# EAGLE design SuperFuzz (EAGLE 5.11)
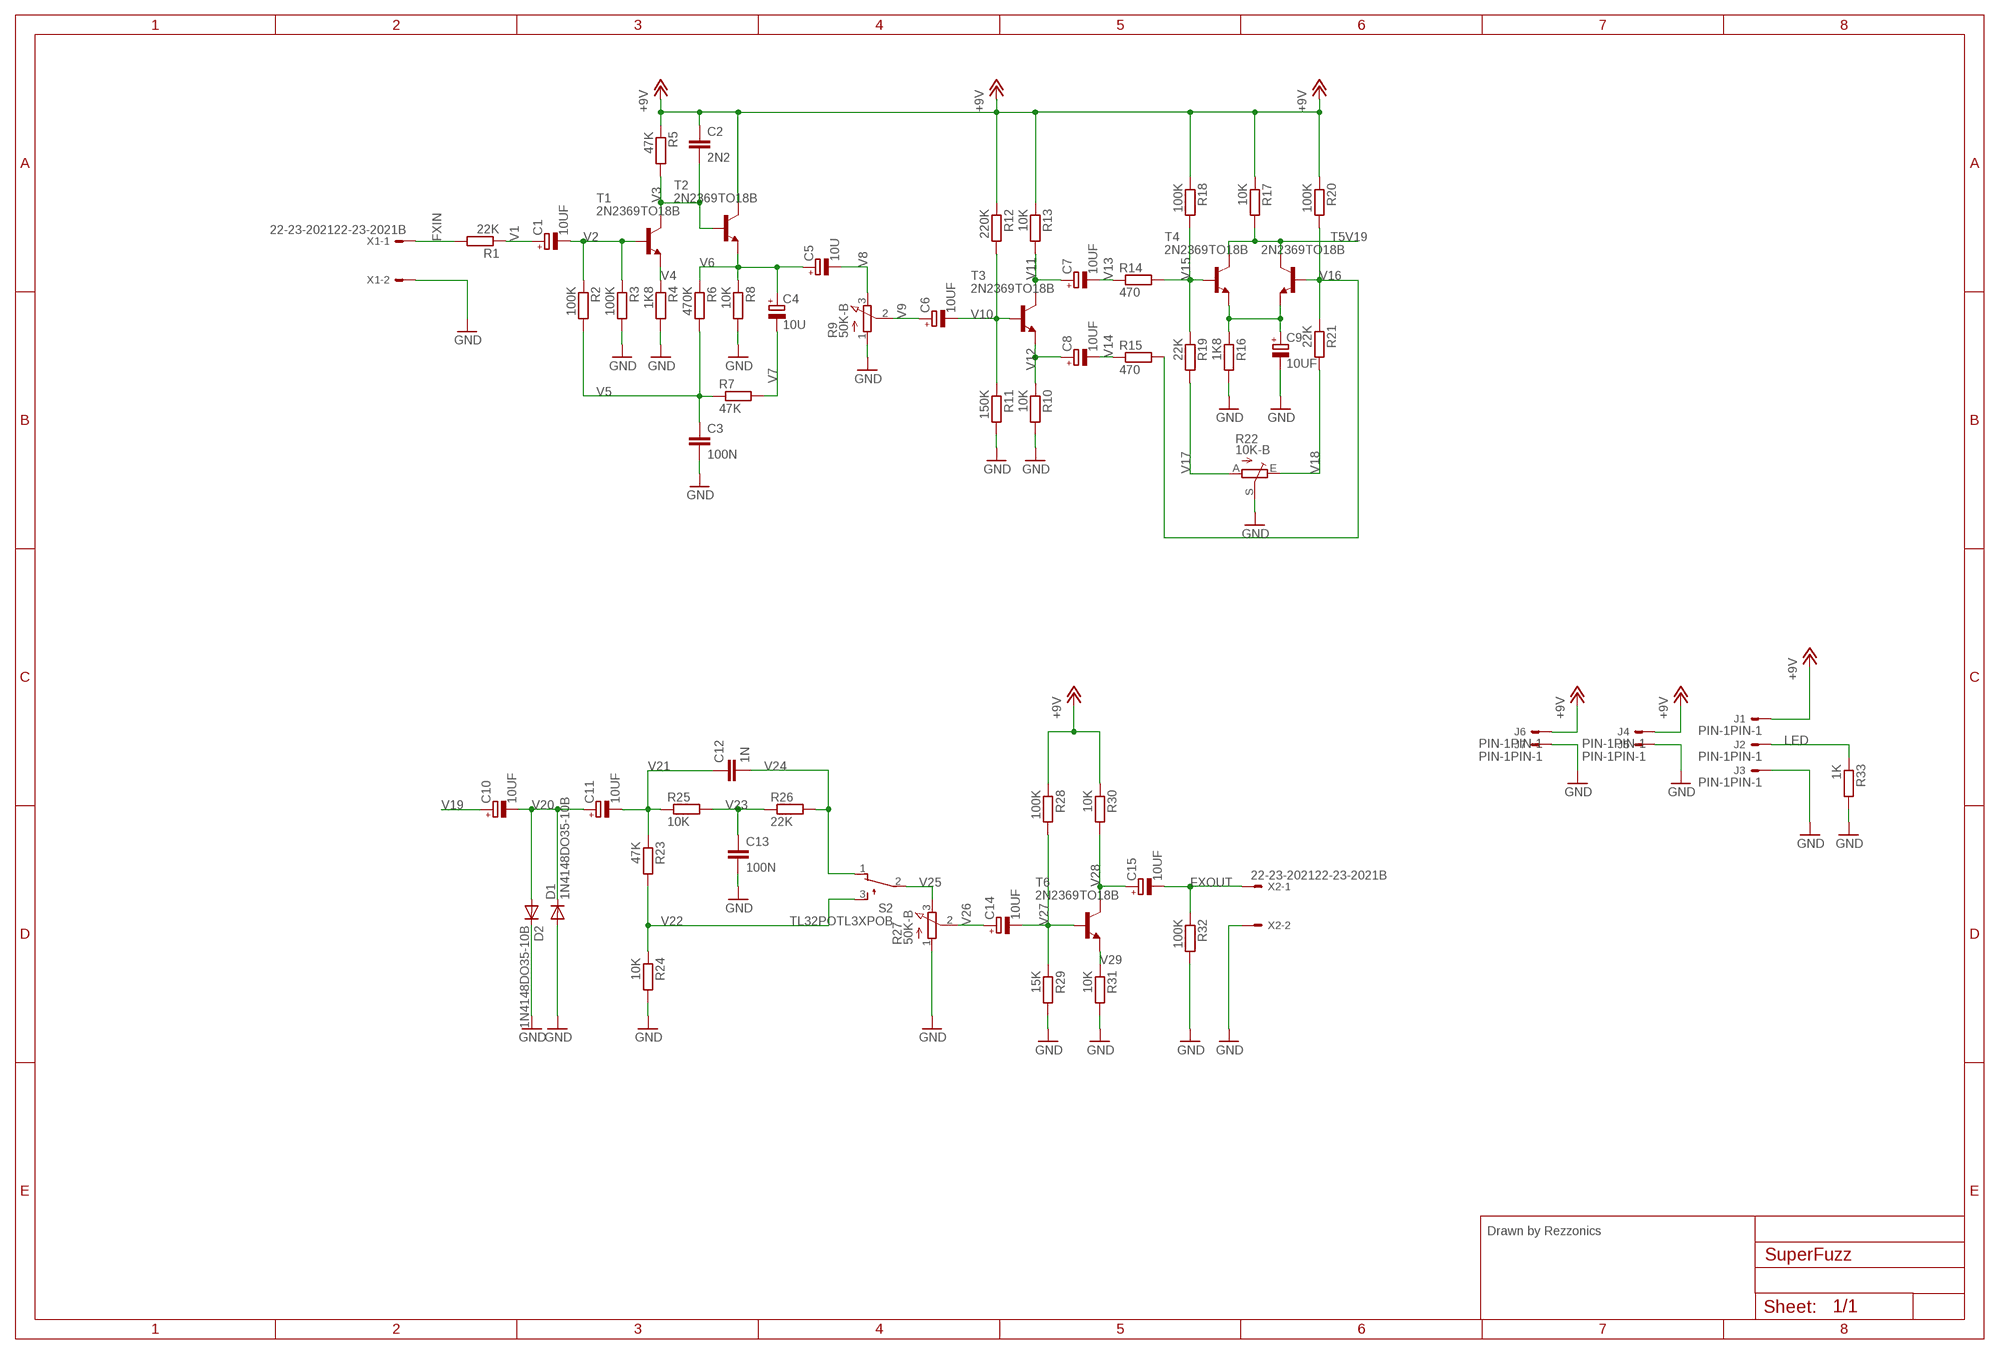
[diagram p0: schematic, sheet 1]

## Parts
C1  10UF  CPOL-EUE5-5B  [E5-5B]
C2  2N2  C-EUC038-024X044B  [C038-024X044B]
C3  100N  C-EUC038-024X044B  [C038-024X044B]
C4  10U  CPOL-EUE5-5B  [E5-5B]
C5  10U  CPOL-EUE5-5B  [E5-5B]
C6  10UF  CPOL-EUE5-5B  [E5-5B]
C7  10UF  CPOL-EUE5-5B  [E5-5B]
C8  10UF  CPOL-EUE5-5B  [E5-5B]
C9  10UF  CPOL-EUE5-5B  [E5-5B]
C10  10UF  CPOL-EUE5-5B  [E5-5B]
C11  10UF  CPOL-EUE5-5B  [E5-5B]
C12  1N  C-EUC038-024X044B  [C038-024X044B]
C13  100N  C-EUC050-024X044B  [C050-024X044B]
C14  10UF  CPOL-EUE5-5B  [E5-5B]
C15  10UF  CPOL-EUE5-5B  [E5-5B]
D1  1N4148DO35-10B  [DO35-10B]
D2  1N4148DO35-10B  [DO35-10B]
J1  PIN-1PIN-1  PIN-1  [PIN-1]
J2  PIN-1PIN-1  PIN-1  [PIN-1]
J3  PIN-1PIN-1  PIN-1  [PIN-1]
J4  PIN-1PIN-1  PIN-1  [PIN-1]
J5  PIN-1PIN-1  PIN-1  [PIN-1]
J6  PIN-1PIN-1  PIN-1  [PIN-1]
J7  PIN-1PIN-1  PIN-1  [PIN-1]
R1  22K  R-EU_0207/10B  [0207/10B]
R2  100K  R-EU_0207/10B  [0207/10B]
R3  100K  R-EU_0207/10B  [0207/10B]
R4  1K8  R-EU_0207/10B  [0207/10B]
R5  47K  R-EU_0207/10B  [0207/10B]
R6  470K  R-EU_0207/10B  [0207/10B]
R7  47K  R-EU_0207/10B  [0207/10B]
R8  10K  R-EU_0207/10B  [0207/10B]
R9  50K-B  3RP/1610NB  [3RP/1610NB]
R10  10K  R-EU_0207/10B  [0207/10B]
R11  150K  R-EU_0207/10B  [0207/10B]
R12  220K  R-EU_0207/10B  [0207/10B]
R13  10K  R-EU_0207/10B  [0207/10B]
R14  470  R-EU_0207/10B  [0207/10B]
R15  470  R-EU_0207/10B  [0207/10B]
R16  1K8  R-EU_0207/10B  [0207/10B]
R17  10K  R-EU_0207/10B  [0207/10B]
R18  100K  R-EU_0207/10B  [0207/10B]
R19  22K  R-EU_0207/10B  [0207/10B]
R20  100K  R-EU_0207/10B  [0207/10B]
R21  22K  R-EU_0207/10B  [0207/10B]
R22  10K-B  TRIM_EU-B64YB  [B64YB]
R23  47K  R-EU_0207/10B  [0207/10B]
R24  10K  R-EU_0207/10B  [0207/10B]
R25  10K  R-EU_0207/10B  [0207/10B]
R26  22K  R-EU_0207/10B  [0207/10B]
R27  50K-B  3RP/1610NB  [3RP/1610NB]
R28  100K  R-EU_0207/10B  [0207/10B]
R29  15K  R-EU_0207/10B  [0207/10B]
R30  10K  R-EU_0207/10B  [0207/10B]
R31  10K  R-EU_0207/10B  [0207/10B]
R32  100K  R-EU_0207/10B  [0207/10B]
R33  1K  R-EU_0207/10B  [0207/10B]
S2  TL32POTL3XPOB  [TL3XPOB]
T1  2N2369TO18B  [TO18B]
T2  2N2369TO18B  [TO18B]
T3  2N2369TO18B  [TO18B]
T4  2N2369TO18B  [TO18B]
T5  2N2369TO18B  [TO18B]
T6  2N2369TO18B  [TO18B]
X1  22-23-202122-23-2021B  22-23-2021B  [22-23-2021B]
X2  22-23-202122-23-2021B  22-23-2021B  [22-23-2021B]

## Nets
+9V: C2.1 J1.1(S) J4.1(S) J6.1(S) R5.1 R12.1 R13.1 R17.1 R18.1 R20.1 R28.1 R30.1 T2.3(C)
FXIN: R1.2 X1.1
FXOUT: C15.- R32.1 X2.1
GND: C3.2 C9.- C13.2 D1.A D2.C J3.1(S) J5.1(S) J7.1(S) R3.2 R4.2 R8.2 R9.1(A) R10.2 R11.2 R16.2 R22.S R24.2 R27.1(A) R29.2 R31.2 R32.2 R33.2 X1.2 X2.2
LED: J2.1(S) R33.1
N$19: C9.+ R16.1 T4.1(E) T5.1(E)
V1: C1.+ R1.1
V2: C1.- R2.1 R3.1 T1.2(B)
V3: C2.2 R5.2 T1.3(C) T2.2(B)
V4: R4.1 T1.1(E)
V5: C3.1 R2.2 R6.2 R7.1
V6: C4.+ C5.+ R6.1 R8.1 T2.1(E)
V7: C4.- R7.2
V8: C5.- R9.3(E)
V9: C6.+ R9.2(S)
V10: C6.- R11.1 R12.2 T3.2(B)
V11: C7.+ R13.2 T3.3(C)
V12: C8.+ R10.1 T3.1(E)
V13: C7.- R14.1
V14: C8.- R15.1
V15: R14.2 R18.2 R19.1 T4.2(B)
V16: R15.2 R20.2 R21.1 T5.2(B)
V17: R19.2 R22.A
V18: R21.2 R22.E
V19: C10.+ R17.2 T4.3(C) T5.3(C)
V20: C10.- C11.+ D1.C D2.A
V21: C11.- C12.1 R23.1 R25.1
V22: R23.2 R24.1 S2.3(S)
V23: C13.1 R25.2 R26.1
V24: C12.2 R26.2 S2.1(O)
V25: R27.3(E) S2.2(P)
V26: C14.+ R27.2(S)
V27: C14.- R28.2 R29.1 T6.2(B)
V28: C15.+ R30.2 T6.3(C)
V29: R31.1 T6.1(E)

## Notes on the sheet
- Drawn by Rezzonics

## Library data of the parts
C1 C4-C11 C14 C15 = rcl:CPOL-EU: POLARIZED CAPACITOR, European symbol
C2 C3 C12 C13 = rcl:C-EU: CAPACITOR, European symbol
D1 D2 = diode:1N4148: DIODE high speed (Philips)
J1-J7 = con-molex:PIN-1: Header - 1 Pin. Drill 1mm
R1-R8 R10-R21 R23-R26 R28-R33 = rcl:R-EU_: RESISTOR, European symbol
R9 R27 = pot:3RP/1610N: 16mm Potentiometer one level Source: http://www.alphapotentiometers.net/html/16mm_pot_2.html
R22 = pot:TRIM_EU-: POTENTIOMETER
S2 = switch:TL32PO: TINY SWITCH ON - MOM Source: http://www2.produktinfo.conrad.com/datenblaetter/700000-724999/705152-da-01-de-Subminiaturschalter_TL_36YO.pdf
T1-T6 = transistor:2N2369: NPN TRANSISTOR
X1 X2 = con-molex:22-23-2021: .100" (2.54mm) Center Header - 2 Pin

## Board
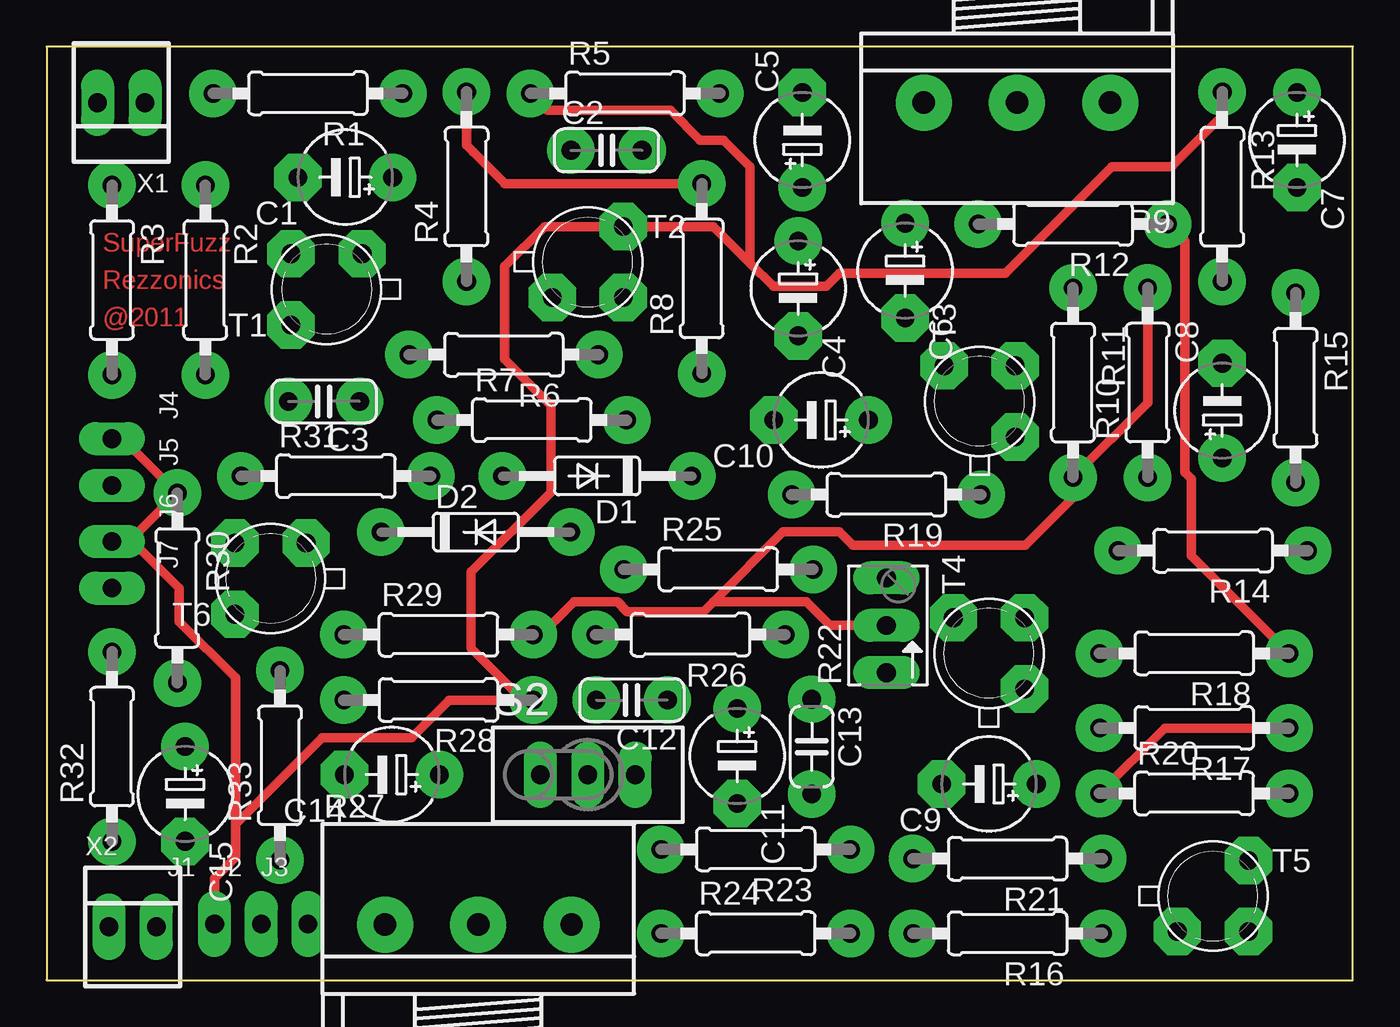
[diagram p1: board, top side]
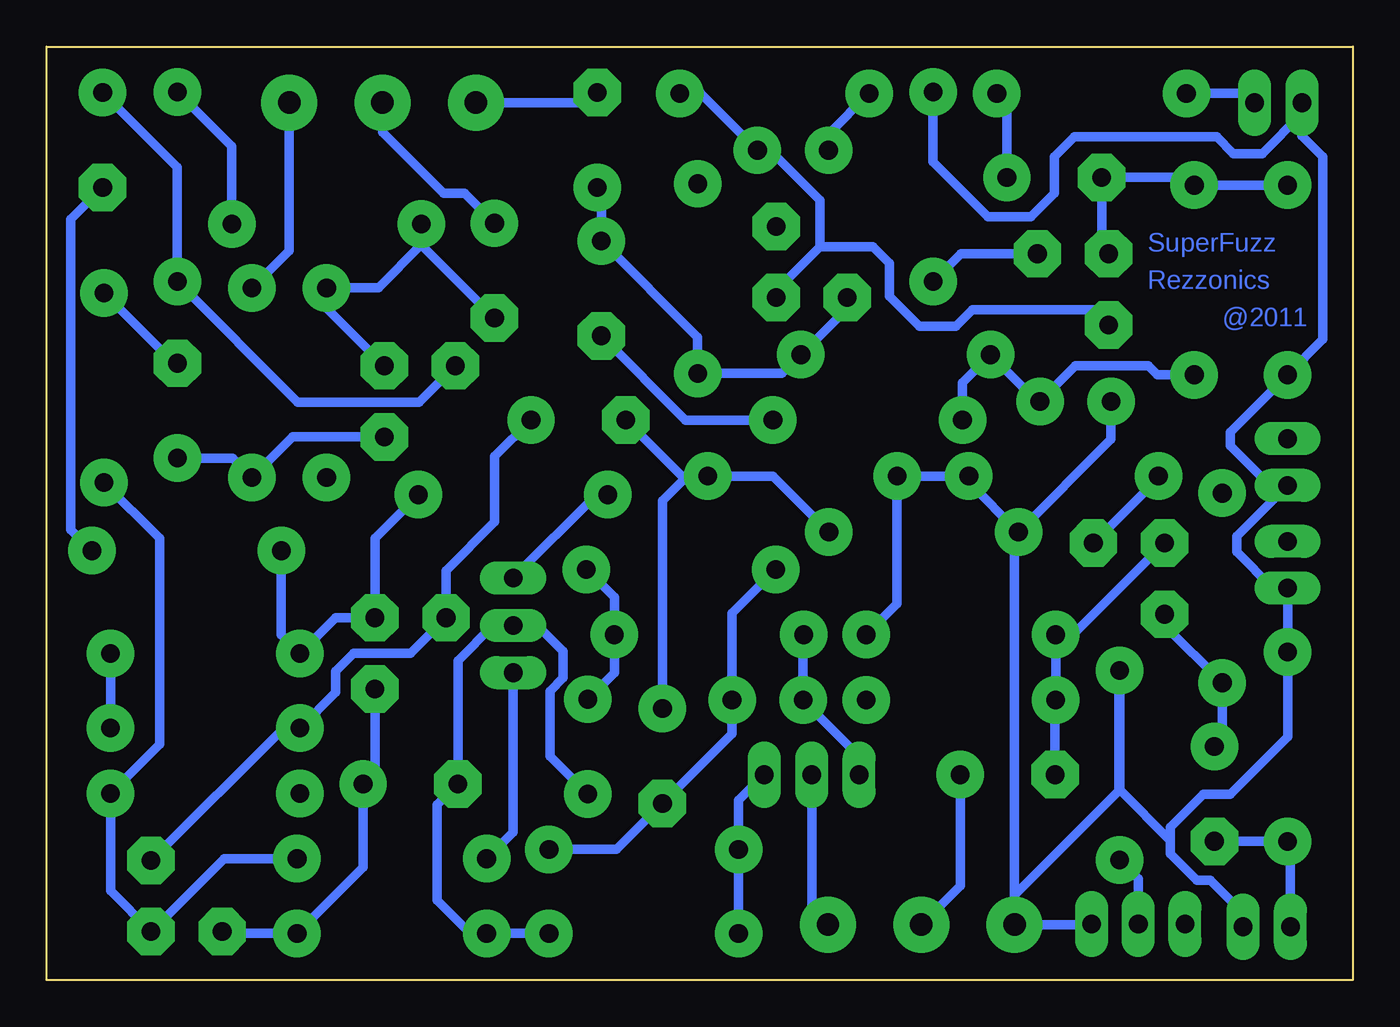
[diagram p2: board, bottom side, seen from below]

Size 70 x 50 mm. Coordinates in mm from the lower left corner, seen from the top.
Outline: 0,0 70,0 70,50 0,50 0,0
Copper layers (1*16): Top 0.035mm / dielectric 1.5mm / Bottom 0.035mm
Design rules "default": minimum track width 10mil, minimum drill 24mil, track to track 8mil, track to pad 8mil, pad to pad 8mil, via to via 8mil, smd to smd 8mil, copper to edge 40mil, drill to drill 8mil, minimum pad ring 10mil, minimum via ring 8mil, stop-mask expansion 4mil, vias tented up to drill 0mil, thermal gap 10mil

### Footprints (pad centres in the part's own frame; a part is rotated, then mirrored left to right if it is on the bottom)
E5-5B = drill 1 pad 2.54 round: + -2.54,0 | drill 1 pad 2.54 octagon: - 2.54,0
C038-024X044B = drill 1 pad 2.54 round: 1 -1.27,0; 2 2.54,0
C050-024X044B = drill 1 pad 2.54 round: 1 -2.54,0; 2 2.54,0
DO35-10B = drill 1 pad 2.54 round: A 5.08,0; C -5.08,0
PIN-1 = drill 1 pad 1.778 long: 1 0,0
0207/10B = drill 1 pad 2.54 round: 1 -5.08,0; 2 5.08,0
3RP/1610NB = drill 1.2 pad 3 round: 1 -5,0; 2 0,0; 3 5,0
B64YB = drill 1 pad 1.778 long: A 2.54,0; E -2.54,0; S 0,0
TL3XPOB = drill 1 pad 1.778 long: 1 -2.54,0; 2 0,0; 3 2.54,0
TO18B = drill 1 pad 2.54 octagon: 1 -1.905,-1.905; 2 1.905,-1.905; 3 1.905,1.905
22-23-2021B = drill 1 pad 1.778 long: 1 -1.27,0; 2 1.27,0

### Placement (x,y rotation side)
C1  16,43 180 top
C2  29.37,44.45 0 top
C3  15.5,31 180 top
C4  40.27,37.05 270 top
C5  40.5,45 90 top
C6  46,38 270 top
C7  67,45 270 top
C8  63,30.5 90 top
C9  50.5,10.5 180 top
C10  41.5,30 180 top
C11  37,12 270 top
C12  32,15 180 top
C13  41,12.5 270 top
C14  18.5,11 180 top
C15  7.42,9.97 270 top
D1  29.5,27 180 top
D2  23,24 0 top
J1  9,3 0 top
J2  11.5,3 0 top
J3  14,3 0 top
J4  3.5,29 270 top
J5  3.5,26.5 270 top
J6  3.5,23.5 270 top
J7  3.5,21 270 top
R1  14,47.5 180 top
R2  8.5,37.5 270 top
R3  3.5,37.5 270 top
R4  22.5,42.5 90 top
R5  31,47.5 0 top
R6  24.5,33.5 180 top
R7  26,30 0 top
R8  35.11,37.58 90 top
R9  52,47 180 top
R10  59,32 90 top
R11  55,32 270 top
R12  55,40.5 180 top
R13  63,42.5 270 top
R14  62.5,23 180 top
R15  66.93,31.73 270 top
R16  51.5,2.5 180 top
R17  61.5,13.5 180 top
R18  61.5,17.5 180 top
R19  45,26 180 top
R20  61.5,10 0 top
R21  51.5,6.5 180 top
R22  45,19 90 top
R23  38,7 180 top
R24  38,2.5 0 top
R25  36,22 0 top
R26  34.5,18.5 180 top
R27  23.13,2.97 0 top
R28  21,15 180 top
R29  21,18.5 0 top
R30  7,21 270 top
R31  15.5,27 0 top
R32  3.5,12.5 90 top
R33  12.5,11.5 90 top
S2  29,11 0 top
T1  15,37 180 top
T2  29,38.47 0 top
T3  50,31 90 top
T4  50.5,17.5 90 top
T5  62.5,4.5 0 top
T6  12,21.5 180 top
X1  4,47 180 top
X2  4.61,2.85 0 top

### Tracks (layer width: path | path; a pad name or v marks a point on that pad's centre or on a via)
+9V
  Top 0.508: 4.51,23.59 4.42,23.5 J6.1 | 4.51,23.59 R30.1 4.08,29 J4.1 | J1.1 9,5.44 10.13,6.58 10.13,8.36 | 10.13,8.36 10.13,16.18 7.11,19.2 7.11,20.98 4.51,23.59 | 10.13,8.36 14.76,12.98 19.56,12.98 21.58,15 R28.1 25.54,15 22.76,17.78 22.76,21.87 27.03,26.14 27.03,30.76 24.54,33.25 24.54,38.23 26.67,40.36 T2.3 | R18.1 61.34,22.74 61.34,26.85 60.98,27.2 60.98,39.59 R12.1 | R17.1 59.92,13.5 R20.1 | R13.1 63,46.29 60.27,43.56 57.07,43.56 51.38,37.87 42.49,37.87 41.78,37.16 38.94,37.16 37.69,38.41 | R5.1 26.84,46.58 33.43,46.58 35.03,44.98 36.27,44.98 37.69,43.56 37.69,38.41 | T2.3 | 37.69,38.41 35.74,40.36 T2.3
  Bottom 0.508: R12.1 60.08,44.66 R13.1 | R18.1 R17.1 | C2.1 28.1,45.32 R5.1
FXIN
  Bottom 0.508: X1.1 5.77,47.5 R1.2
FXOUT
  Bottom 0.508: X2.1 3.34,7.26 R32.1 C15.-
GND
  Top 0.508: R4.2 22.5,44.71 22.85,44.36 24.54,42.67 24.55,42.66 R8.2 | R10.2 59,30.92 R11.2 55,25.84 52.45,23.29 43.2,23.29 42.49,24 39.47,24 35.74,20.27 | 35.74,20.27 40.72,20.27 41.98,19 R22.S | 35.74,20.27 35.2,19.74 31.11,19.74 30.58,20.27 28.27,20.27 26.5,18.5 R29.2
  Bottom 0.508: D2.C 20.58,26.66 R31.2 D1.A 24.42,20.16 R29.2 | D2.C 12.96,28.96 C3.2 | D2.C 18.13,23.79 R27.1 | R27.1 18.13,4.55 12.55,10.13 12.55,16.53 R33.2 12.5,10.19 9.78,7.47 | 9.78,7.47 9.78,6.76 8.36,5.33 7.64,5.33 5.88,3.57 X2.2 | 9.78,7.47 9.78,8.18 8,9.96 6.58,9.96 3.5,13.04 R32.2 J7.1 4.29,21 6.22,22.94 6.22,23.78 J5.1 4.45,26.5 6.58,28.63 6.58,29.34 R3.2 1.6,34.32 1.6,44.09 2.73,45.22 2.73,46.41 | 2.73,46.41 X1.2 | R4.2 22.5,43.84 19.56,40.89 17.25,40.89 16,42.14 16,44.09 14.94,45.16 7.29,45.16 6.4,44.27 4.86,44.27 2.73,46.41 | R24.2 R16.2 47.31,2.5 49.07,4.27 49.07,9.39 C9.- 47.96,17.11 46.08,19 R22.S 43.71,19 42.32,17.6 42.32,16.18 43.03,15.47 43.03,11.99 C13.2 | R10.2 57,39.08 R9.1 57,47.19 | R27.1 14.03,2.97 J3.1
LED
  Bottom 0.508: J2.1 11.5,5.42 R33.1
N$19
  Bottom 0.508: T4.1 52.41,11.13 C9.+ 53.04,6.04 R16.1 60.5,2.5 T5.1
V1
  Bottom 0.508: R1.1 18.54,46.96 C1.+
V2
  Bottom 0.508: R3.1 R2.1 8.92,43 C1.- 13.46,39.27 T1.2
V3
  Bottom 0.508: T2.2 30.76,37.09 28.56,39.29 | 28.56,39.29 25.71,39.29 24.82,38.41 24.82,36.63 23.23,35.03 21.27,35.03 20.38,35.92 13.92,35.92 T1.3 | 28.56,39.29 28.56,41.78 31.23,44.45 C2.2 34.96,47.5 R5.2
V4
  Bottom 0.508: T1.1 21.02,38.91 R4.1
V5
  Bottom 0.508: R2.2 10.48,32.42 10.96,32.89 14.88,32.89 C3.1 16.92,31 R6.2 20.92,32 R7.1
V6
  Bottom 0.508: T2.1 27.09,35.98 R6.1 30.58,32.5 R8.1 35.11,34.43 C4.+ 40.27,42.23 C5.+
V7
  Bottom 0.508: C4.- 35.76,30 R7.2
V8
  Bottom 0.508: C5.- 41.04,47 R9.3
V9
  Bottom 0.508: R9.2 52,45.42 48.72,42.14 47.6,42.14 C6.+
V10
  Bottom 0.508: 49.92,39.38 R12.2 | C6.- 49.92,39.38 | 49.92,39.38 52.22,37.08 R11.1 55,36 T3.2
V11
  Bottom 0.508: C7.+ 63,43.54 R13.2 56.54,30.96 50.04,30.96 T3.3
V12
  Bottom 0.508: C8.+ 60.04,27.96 R10.1 56.83,29.09 T3.1
V13
  Bottom 0.508: R14.1 68.71,24.13 68.71,40.75 C7.-
V14
  Bottom 0.508: C8.- 63.16,33.04 R15.1
V15
  Bottom 0.508: R14.2 57.42,18.5 R18.2 54.52,19.41 T4.2 52.41,23.68 R19.1
V16
  Bottom 0.508: R15.2 63.94,23.66 63.94,12.64 R20.2 66.58,4.77 T5.2 60.5,6.5 R21.1
V17
  Bottom 0.508: R19.2 40.54,26 R22.A
V18
  Bottom 0.508: R22.E 45,7.92 R21.2
V19
  Bottom 0.508: T5.3 57.31,13.5 R17.2 54.52,15.4 54.52,16.54 53.55,17.5 50.5,17.5 T4.3 48.59,21.93 45.98,24.54 45.98,28.06 C10.+
V20
  Bottom 0.508: C10.- 35.96,27 35.67,27 | 35.67,27 D1.C 31.08,27 D2.A | C11.+ 37,25.67 35.67,27
V21
  Bottom 0.508: R25.1 33.27,19.65 C12.1 33.27,13.19 C11.- 39.46,7 R23.1
V22
  Bottom 0.508: S2.3 32.92,9.62 R23.2 R24.1
V23
  Bottom 0.508: R25.2 39.58,20.5 R26.1 39.58,16.46 C13.1
V24
  Bottom 0.508: S2.1 26.46,12 C12.2 29.46,18.46 R26.2
V25
  Bottom 0.508: S2.2 29,3.84 R27.3
V26
  Bottom 0.508: C14.+ 21.04,5.06 R27.2
V27
  Bottom 0.508: C14.- 15.96,14.96 R28.2 R29.1 15,18.5 T6.2
V28
  Bottom 0.508: T6.3 10.1,19.02 R30.2 7,12.93 C15.+
V29
  Bottom 0.508: R31.1 10.42,26.89 T6.1

### Text on the board
Top: SuperFuzz | Rezzonics | @2011
Bottom: SuperFuzz | Rezzonics | @2011